# EAGLE design Singularitron Flashlight Module v1 (EAGLE 7.3.0)
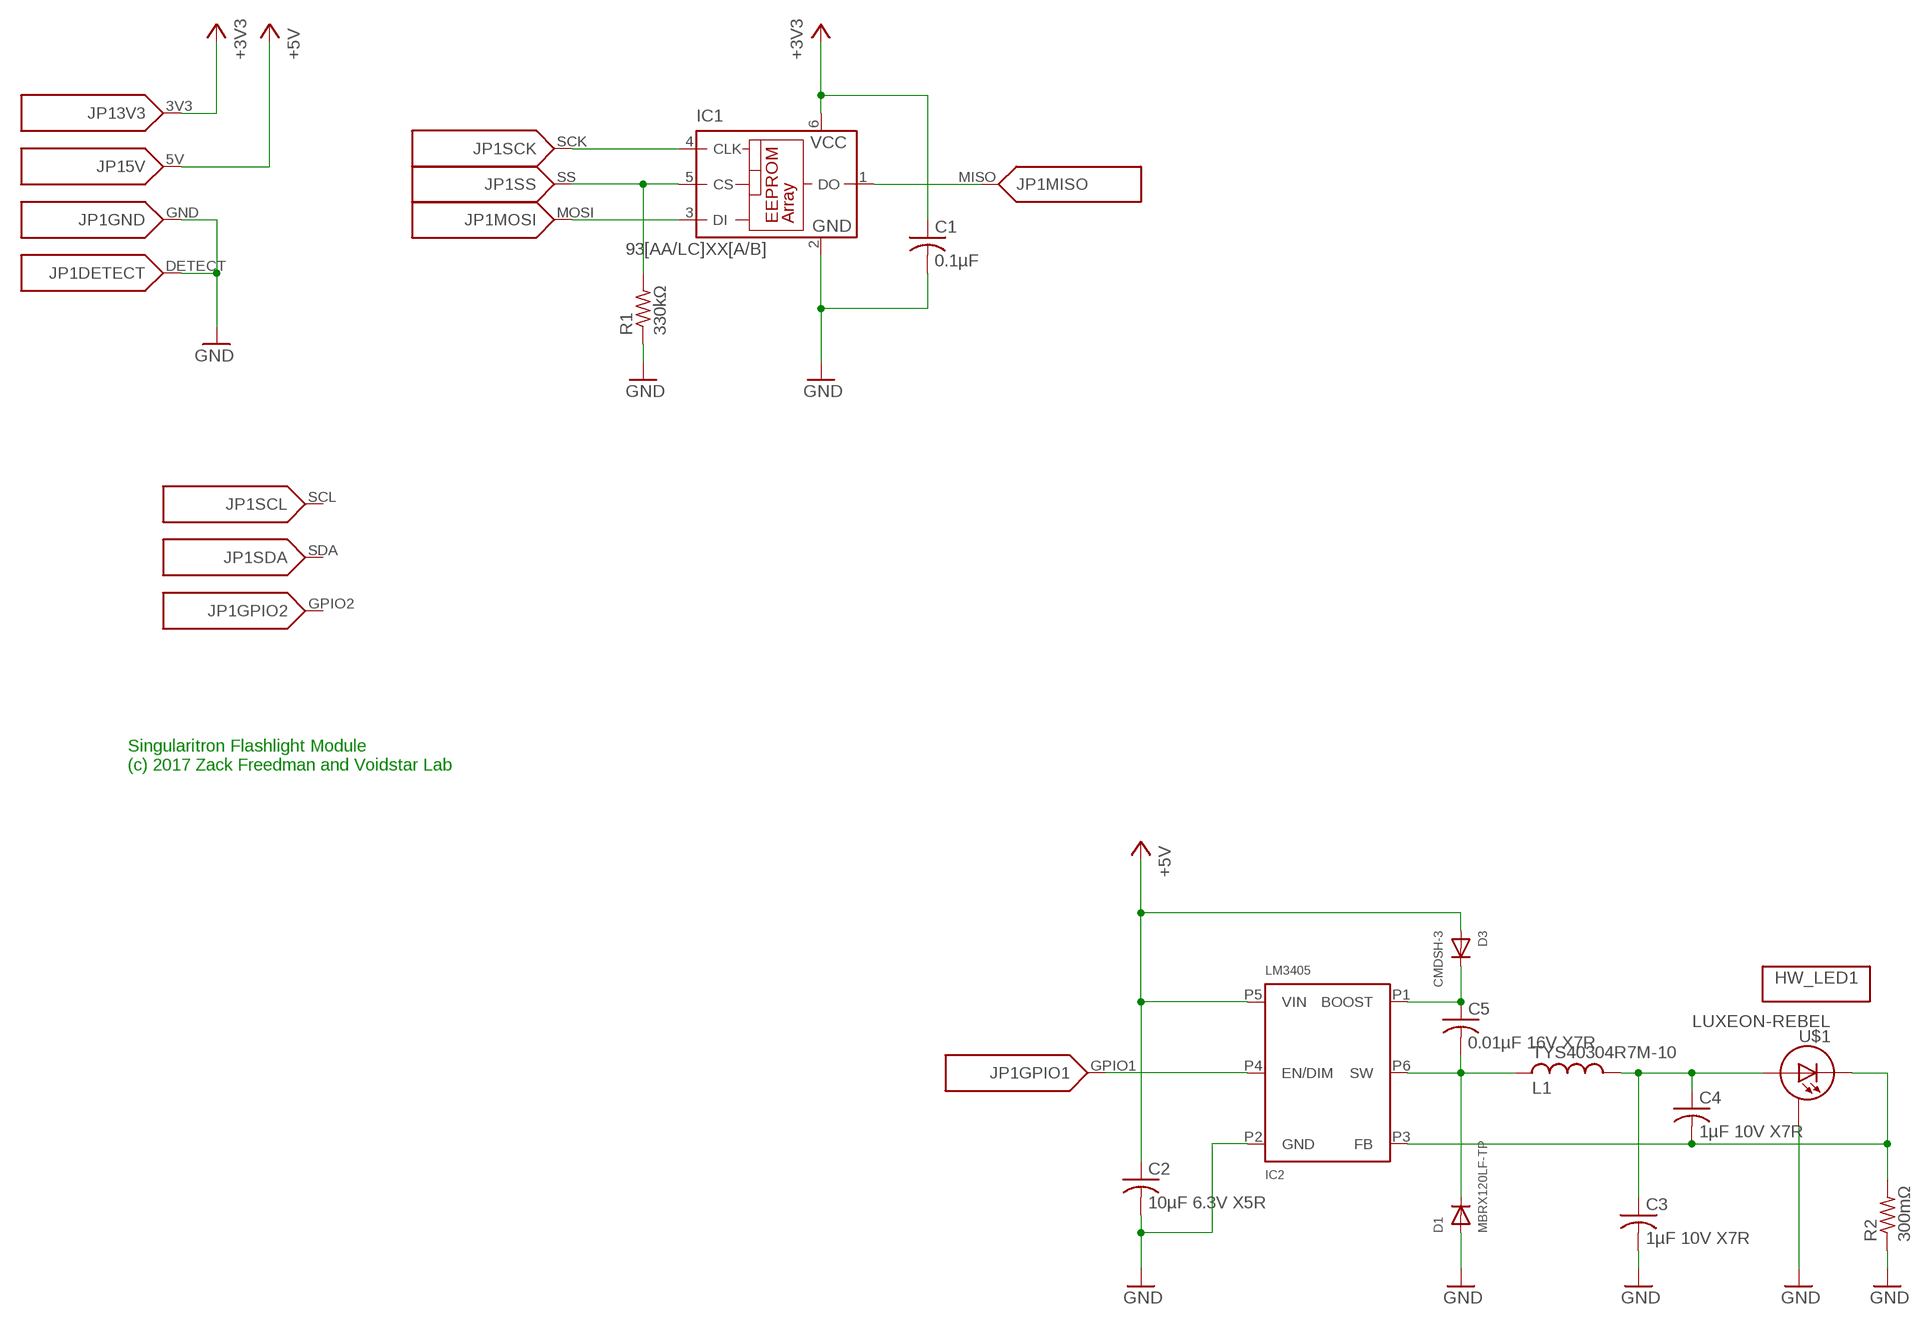
[diagram p0: schematic, sheet 1]

## Parts
C1  0.1µF  C-USC0603  [C0603]
C2  10µF 6.3V X5R  C-USC0805  [C0805]
C3  1µF 10V X7R  C-USC0805  [C0805]
C4  1µF 10V X7R  C-USC0805  [C0805]
C5  0.01µF 16V X7R  C-USC0603  [C0603]
D1  MBRX120LF-TP  DIODESOD-123  [SOD-123]
D3  CMDSH-3  DIODESOD-323F  [SOD-323F]
HW_LED1  CARCLO_10771_10772  [CARCLO_10MM_NARROW_MEDIUM]
IC1  93[AA/LC]XX[A/B]  93AA76A  [SOT23-6]
IC2  LM3405  [SOT-23]
JP1  SINGULARITRON_CART_BASE  [SINGULARITRON_CART_BASE]
L1  TYS40304R7M-10  [TYS40304R7M-10]
R1  330kΩ  R-US_R0603  [R0603]
R2  300mΩ  R-US_R0805  [R0805]
U$1  LUXEON-REBEL  [LUXEON-REBEL]

## Nets
+3V3: C1.1 IC1.6(VCC) JP1.3V3
+5V: C2.1 D3.A IC2.P5(VIN) JP1.5V
GND: C1.2 C2.2 C3.2 D1.A IC1.2(GND) IC2.P2(GND) JP1.DETECT JP1.GND R1.1 R2.1 U$1.P$3(S)
N$1: IC1.5(CS) JP1.SS R1.2
N$5: IC1.4(CLK) JP1.SCK
N$6: IC1.3(DI) JP1.MOSI
N$7: IC1.1(DO) JP1.MISO
N$9: IC2.P4(EN/DIM) JP1.GPIO1
N$12: C5.1 D3.C IC2.P1(BOOST)
N$13: C5.2 D1.C IC2.P6(SW) L1.P$2
N$14: C3.1 C4.1 L1.P$1 U$1.ANODE(A)
N$17: C4.2 IC2.P3(FB) R2.2 U$1.CATHODE(C)
Unconnected: JP1.GPIO2 JP1.SCL JP1.SDA

## Notes on the sheet
- Singularitron Flashlight Module
  (c) 2017 Zack Freedman and Voidstar Lab

## Library data of the parts
C1-C5 = rcl:C-US: CAPACITOR, American symbol
D1 D3 = adafruit:DIODE: Diode SMADIODE - SMA Surface Mount Package 20V 1A Schottky Diode Digikey: 641-1014-6-ND DO-1N4148 - Through Hole Small Current Diode SOD-123 20V 1 A (.5mV Vf) Schottky Diode - Digikey: MBRX120TPMSCT-ND SOD-323 10V 570mA (.38mV Vf, 3ns) Schottky Diode - Digikey: ZLLS410CT-ND SOD-523 30V 30mA Schottky Diode (RB751S-40TE61) - Digikey: RB751S-40TE61CT-ND SOT23-R/W - SOT23 Package (R = Solder Paste/Reflow Ovens, W = Hand-Soldering) BAT54Film 40V 300mA - Digikey: 497-7162-1-ND
HW_LED1 = Voidstar-Exotic:CARCLO_10771_10772
IC1 = microchip:93*76?: 8K Microwire Compatible Serial EEPROM Source: http://ww1.microchip.com/downloads/en/DeviceDoc/21796H.pdf; MPN: 93AA76AT-I/OT; OC_FARNELL: 1331443; OC_NEWARK: 35M2481
IC2 = Voidstar-Integrated:LM3405: TI LM3405 1A constant-current LED driver Buck regulator, input 3-15V Minimum 1.8V control voltage
JP1 = Voidstar-Exotic:SINGULARITRON_CART_BASE
L1 = Voidstar-Passive:TYS40304R7M-10: Laird TYS40304R7M-10 4.7µH 2A shielded inductor, for high-speed switchers, compact 4x4mm package
R1 R2 = rcl:R-US_: RESISTOR, American symbol
U$1 = SparkFun-LED:LUXEON-REBEL: Luxeon Rebel single-color high output LED

## Board
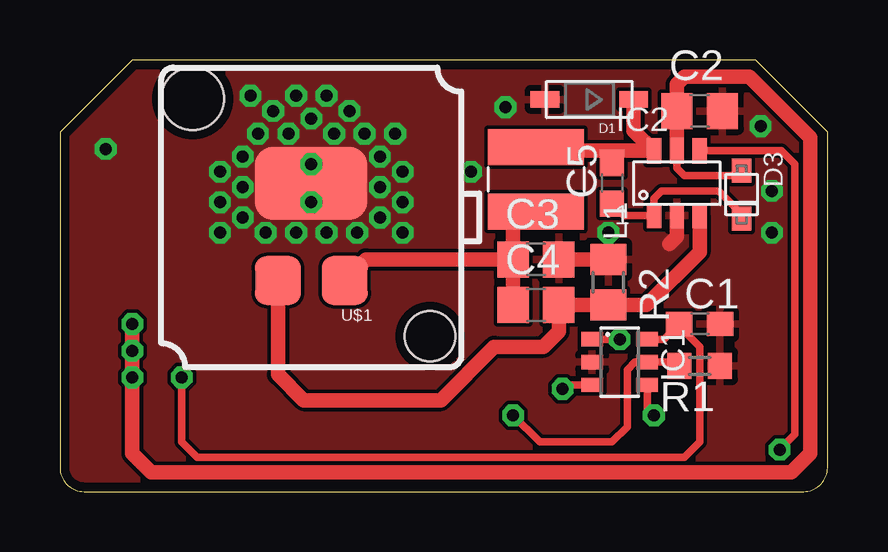
[diagram p1: board, top side]
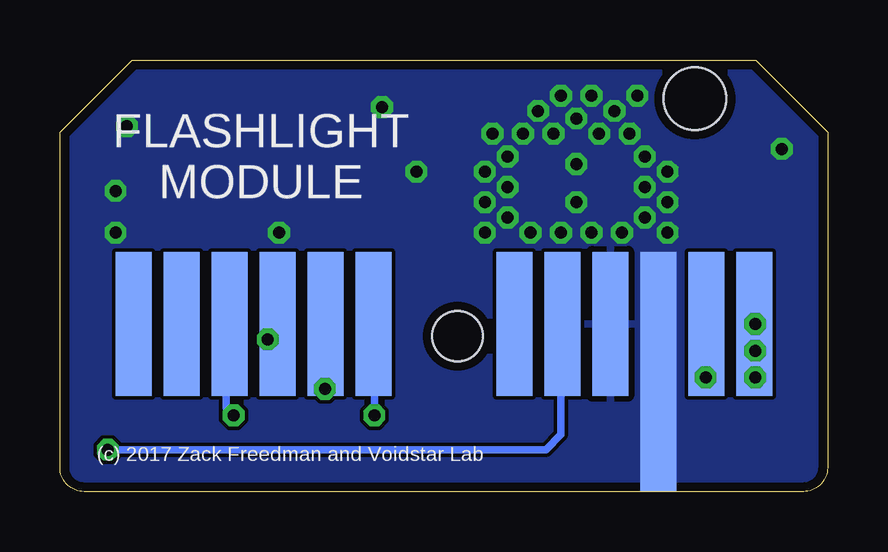
[diagram p2: board, bottom side, seen from below]

Size 32 x 18 mm. Coordinates in mm from the lower left corner, seen from the top.
Outline: 29,18 3,18 0,15 0,1 arc90 1,0 31,0 arc90 32,1 32,15 29,18
Copper layers (1*16): Top 0.035559375mm / dielectric 1.501140625mm / Bottom 0.035559375mm
Design rules "typical_4pcb *": minimum track width 10mil, minimum drill 15mil, track to track 6mil, track to pad 6mil, pad to pad 6mil, via to via 6mil, smd to smd 6mil, copper to edge 15mil, drill to drill 8mil, minimum pad ring 10mil, minimum via ring 8mil, stop-mask expansion 4mil, vias tented up to drill 20mil, thermal gap 10mil

### Footprints (pad centres in the part's own frame; a part is rotated, then mirrored left to right if it is on the bottom)
C0603 = smd 1.1 x 1: 1 -0.85,0; 2 0.85,0
C0805 = smd 1.3 x 1.5: 1 -0.95,0; 2 0.95,0
SOD-123 = smd 1.2 x 0.7: A 1.85,0; C -1.85,0
SOD-323F = smd 1 x 0.8: A -1,0; C 1,0
CARCLO_10MM_NARROW_MEDIUM = hole 2.1: 4.95,-4.95 | hole 2.6: -4.95,4.95
SOT23-6 = smd 0.6 x 0.9: 1 -0.95,-1.15; 2 0,-1.15; 3 0.95,-1.15; 4 0.95,1.15; 5 0,1.15; 6 -0.95,1.15
SOT-23 = smd 0.6 x 1.05: P1 -0.95,-1.35; P2 0,-1.35; P3 0.95,-1.35; P4 0.95,1.35; P5 0,1.35; P6 -0.95,1.35
SINGULARITRON_CART_BASE = smd 1.5 x 6 bottom: 3V3 5.062,7; 5V 3.062,7; DETECT 9.062,7; GPIO1 11.062,7; GPIO2 13.062,7; MISO 22.938,7; MOSI 20.938,7; SCK 24.938,7; SCL 28.938,7; SDA 26.938,7; SS 18.938,7 | smd 1.5 x 10 bottom: GND 7.062,5
TYS40304R7M-10 = smd 1.5 x 4: P$1 -1.35,0; P$2 1.35,0
R0603 = smd 1 x 1.1: 1 -0.85,0; 2 0.85,0
R0805 = smd 1.3 x 1.5: 1 -0.95,0; 2 0.95,0
LUXEON-REBEL = smd 1.91 x 2.03: ANODE -1.39,2.63; CATHODE 1.39,2.63 | smd 4.68 x 3.03: P$3 0,-1.42

### Placement (x,y rotation side)
C1  26.67,6.99 0 top
C2  26.67,15.88 0 top
C3  19.84,9.68 0 top
C4  19.84,7.78 0 top
C5  23.02,12.86 90 top
D1  22.07,16.35 180 top
D3  28.42,12.38 270 top
HW_LED1  10.48,11.43 0 top
IC1  23.34,5.4 270 top
IC2  25.72,12.86 0 top
JP1  0,0 0 top
L1  19.84,13.02 90 top
R1  26.67,5.24 180 top
R2  22.86,8.73 270 top
U$1  10.48,11.43 180 top

### Tracks (layer width: path | path; a pad name or v marks a point on that pad's centre or on a via)
+3V3  (via drill 0.5)
  Top 0.305: IC1.6 25.18,6.35 C1.1 26.19,6.61 26.19,6.51 26.67,6.03 26.67,2.06 26.04,1.43 5.71,1.43 5.08,2.06 v5.08,4.76
  Bottom 0.305: JP1.3V3 5.06,4.78 v5.08,4.76
+5V  (via drill 0.5)
  Top 0.305: IC2.P5 25.72,13.49 26.04,13.18 28.21,13.18 D3.A | C2.1
  Top 0.61: IC2.P5 C2.1 | v3.02,6.99 v3.02,5.87 v3.02,4.76 3.02,1.59 3.81,0.79 30.48,0.79 31.27,1.59 31.27,14.76 28.73,17.3 26.04,17.3 25.72,16.99 C2.1
  Bottom 0.305: JP1.5V 3.03,7 v3.02,6.99
GND  (via drill 0.5)
  Top 0.61: C3.2 R2.1 | IC2.P2 25.72,10.64 25.4,10.32
  other vias: 9.84,10.79 29.21,15.24 1.91,14.29 12.06,15.88 11.11,10.79 12.38,10.79 8.57,10.79 7.62,11.43 13.34,11.43 13.34,12.7 13.34,13.97 7.62,12.7 7.62,13.97 8.26,14.92 12.7,14.92 11.43,14.92 9.53,14.92 10.48,15.56 8.89,15.88 13.97,14.92 14.29,13.34 14.29,12.06 14.29,10.79 11.11,16.51 9.84,16.51 6.67,10.79 6.67,12.06 6.67,13.34 7.94,16.51 22.86,10.79 18.57,16.03 17.14,13.34 29.69,10.79 29.69,12.54 10.48,13.65 10.48,12.06
  pour Top: 0,0 0,19.05 33.02,19.05 33.02,0
  pour Bottom: 0,0 0,19.05 33.02,19.05 33.02,0
N$1  (via drill 0.5)
  Top 0.305: R1.2 25.66,5.4 IC1.5 23.97,5.4 23.65,5.08 23.65,2.7 23.02,2.06 20,2.06 v18.89,3.17
  Bottom 0.305: v18.89,3.17 18.89,6.95 JP1.SS
N$5  (via drill 0.5)
  Top 0.305: IC1.4 24.49,3.45 v24.77,3.17
  Bottom 0.305: v24.77,3.17 25.08,3.49 25.08,4.6 24.94,4.75 JP1.SCK
N$6  (via drill 0.5)
  Top 0.305: IC1.3 21.12,4.45 v20.95,4.29
  Bottom 0.305: JP1.MOSI 20.94,4.3 v20.95,4.29
N$7  (via drill 0.5)
  Top 0.305: IC1.1 v23.34,6.35
  Bottom 0.305: v23.34,6.35 22.94,6.75 JP1.MISO
N$9  (via drill 0.5)
  Top 0.305: IC2.P4 30.08,14.21 30.64,13.65 30.64,2.38 v30,1.75
  Bottom 0.305: v30,1.75 11.75,1.75 11.11,2.38 11.11,6.99 11.1,7 JP1.GPIO1
N$12
  Top 0.305: C5.1 23.52,11.51 IC2.P1 24.77,12.23 25.08,12.54 27.46,12.54 28.42,11.59 D3.C
N$13
  Top 0.61: L1.P$2 20,14.21 23.02,14.21 | 23.02,14.21 IC2.P6 23.92,15.06 D1.C | C5.2 23.02,14.21
N$14
  Top 0.61: L1.P$1 19.77,11.59 19.21,11.59 18.89,11.27 C3.1 | C3.1 C4.1 | U$1.ANODE 12.75,9.68 C3.1
N$17
  Top 0.61: IC2.P3 26.67,10 24.45,7.78 R2.2 C4.2 20.8,6.67 20.16,6.03 18.1,6.03 15.88,3.81 10.16,3.81 9.09,4.88 U$1.CATHODE

### Text on the board
bPlace: FLASHLIGHT / MODULE | (c) 2017 Zack Freedman and Voidstar Lab